# Altium schematic sheet TPS5430.SchDoc
size A; SheetNumber: 2; SheetTotal: 2
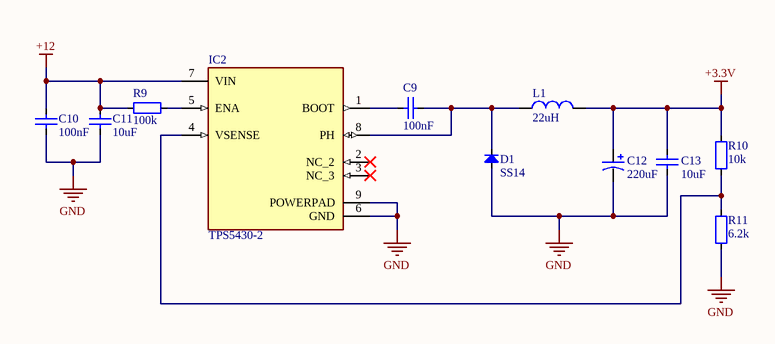
[diagram p0: TPS5430.SchDoc]

## Parts
C9  100nF  [CAP_0805]
C10  100nF  [CAP_0805]
C11  10uF  [CAP_0805]
C12  220uF  [CAP_7343]
C13  10uF  [CAP_0805]
D1  SS14  [DO-214AC(SMA)]
IC2  TPS5430-2  [TPS5430]
L1  22uH  [L_SMD]
R9  100k  [RES-SMD-0805]
R10  10k  [RES-SMD-0805]
R11  6.2k  [RES-SMD-0805]

## Nets
+3.3V: C12.1 C13.1 L1.2 R10.2
+12: C10.2 C11.2 IC2.7(VIN) R9.1
GND: C10.1 C11.1 C12.2 C13.2 D1.1(A) IC2.6(GND) IC2.9(POWERPAD) R11.1
NetC9_1: C9.1 D1.2(K) IC2.8(PH) L1.1
NetC9_2: C9.2 IC2.1(BOOT)
NetIC2_4: IC2.4(VSENSE) R10.1 R11.2
NetIC2_5: IC2.5(ENA) R9.2

Not connected (* = marked no-connect by the designer): IC2 2(NC_2)* 3(NC_3)*

## Library data of the parts
C9-C11 C13 = CapSMD: Capacitor; Value: 33p; Published: 8-Jun-2000; LatestRevisionDate: 17-Jul-2002; LatestRevisionNote: Re-released for DXP Platform.; PackageReference: RAD-0.3; Publisher: Altium Limited
C12 = CAP_TAN_SMD: Polazied Tantalum Capacitor
D1 = Diode SMD: SS34 Diode Schottky 3A 40V SMA(DO-214AC); Code - JEDEC: DO-214-AB; Value: 1N5007; Published: 8-Jun-2000; Revision: July-2002: Re-released for DXP Platform.; Publisher: Altium Limited
L1 = Inductor: CD73R 22uH 1.23A 7345; Value: 150 mH
R9-R11 = Resistor - SMD: Resistor; Manufacturer: Generic Components; Class: Passive; Published: 08/06/2000; Publisher: Altium Hobart Technology Centre